# Altium schematic sheet Mic_SPK2.SchDoc
size A
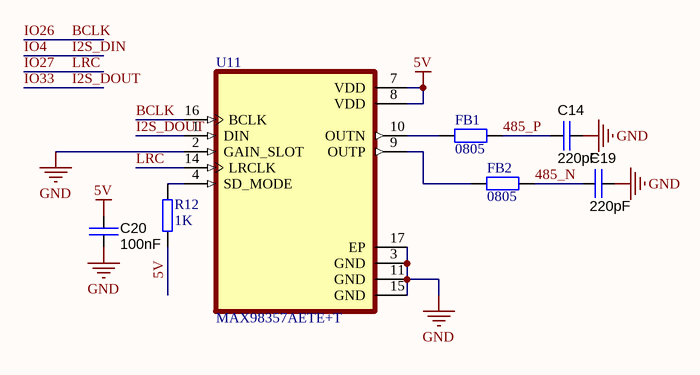
[diagram p0: Mic_SPK2.SchDoc]

## Parts
C14  220pF  [CAPC1608X90N]
C19  220pF  [CAPC1608X90N]
C20  100nF  [CAPC1608X90N]
FB1  value 0805  [DIEN TRO 0805]  (hidden comment: R0805)
FB2  value 0805  [DIEN TRO 0805]  (hidden comment: R0805)
R12  value 1K  [SMT0603]  (hidden comment: Resistor)
U11  MAX98357AETE+T  [QFN50P300X300X80-17N]

## Nets
5V: C20.1 R12.1 U11.7(VDD) U11.8(VDD)
GND: C14.2 C19.2 C20.2 U11.2(GAIN_SLOT) U11.3(GND) U11.11(GND) U11.15(GND) U11.17(EP)
485_N: C19.1 FB2.2
485_P: C14.1 FB1.2
BCLK: U11.16(BCLK)  [also labelled IO26]
I2S_DOUT: U11.1(DIN)  [also labelled IO33]
IO27: U11.14(LRCLK)  [also labelled LRC]
NetFB1_1: FB1.1 U11.10(OUTN)
NetFB2_1: FB2.1 U11.9(OUTP)
NetR12_2: R12.2 U11.4(SD_MODE)

## Library data of the parts
C14 C19 C20 = CAP C_0603: Capacitor SMD Cer 470nF 10% 16V X7R 0603; Manufacturer 1: Murata Electronics North America; Manufacturer Part Number 1: GRM188R71C474KA88D; Ratings: 16V; X7R; Material: ceramic; SCDType: spec; Package / Case: 0603 (1608 metric); Tolerance: ±10%; Manufacturer 2: TDK Corporation; Manufacturer Part Number 2: C1608X7R1C474K; Supplier 1: Digi-Key; Supplier Part Number 1: 490-3295-2-ND; Supplier 2: Digi-Key; Supplier Part Number 2: 445-5192-2-ND; Supplier 3: Digi-Key; Supplier Part Number 3: 587-1250-2-ND; Manufacturer 3: Taiyo Yuden; Manufacturer Part Number 3: EMK107B7474KA-T; Manufacturer 4: Samsung; Manufacturer Part Number 4: CL10B474KONE; ComponentLink1URL: http://psearch.murata.com/capacitor/product/GRM188R71C474KA88#.pdf; ComponentLink1Description: http://psearch.murata.com/capacitor/product/GRM188R71C474KA88#.pdf; ComponentLink2URL: http://product.tdk.com/capacitor/mlcc/en/documents/mlcc_commercial_general_en.pdf; ComponentLink2Description: http://product.tdk.com/capacitor/mlcc/en/documents/mlcc_commercial_general_en.pdf; ComponentLink3URL: http://www.yuden.co.jp/or/product/category/capacitor/EMK107B7474KA-T.pdf; ComponentLink3Description: http://www.yuden.co.jp/or/product/category/capacitor/EMK107B7474KA-T.pdf
  C14 C19: Value: 220pF
  C20: Value: 100nF
FB1 FB2 = R0805: Resistor SMD 0805; Published: 8-Jun-2000; LatestRevisionDate: 17-Jul-2002; LatestRevisionNote: Re-released for DXP Platform.; PackageReference: AXIAL-0.4; Publisher: Altium Limited
R12 = RES-SM-0603-1K: RES SM 0603 1K
U11 = MAX98357AETE+T: Amplifier IC 1-Channel _Mono_ Class D 16-TQFN _3x3_; MF: Maxim Integrated; MP: MAX98357AETE+T; Availability: Unavailable; SnapEDA_Link: https://www.snapeda.com/parts/MAX98357AETE%2BT/Maxim%20Integrated/view-part/48842/?ref=snap; Package: TQFN-16 Maxim; Price: None; Value: *